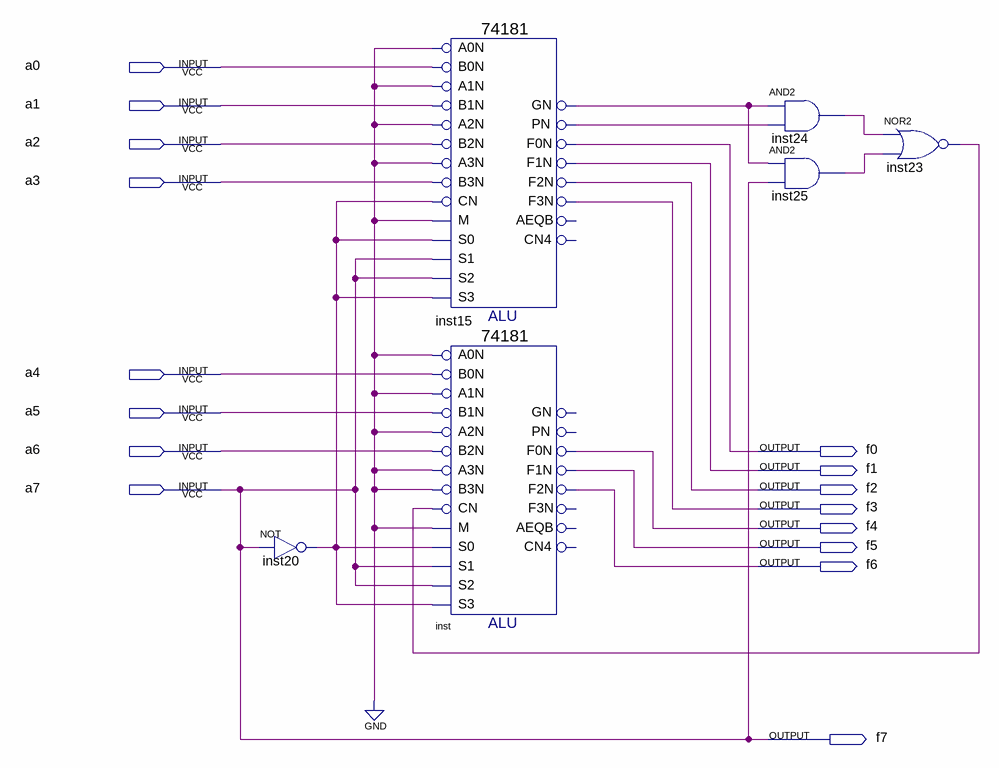
[diagram p0: schematic sheet]
// Quartus schematic BYDecoder.bdf as structural Verilog: 6 symbols, 16 pins
module BYDecoder (
  input  a0,
  input  a1,
  input  a2,
  input  a3,
  input  a4,
  input  a5,
  input  a6,
  input  a7,
  output f0,
  output f1,
  output f2,
  output f3,
  output f4,
  output f5,
  output f6,
  output f7
);

  wire inst15_gn, inst15_pn, inst20_out, inst23_out, inst24_out, inst25_out;

  not inst20 (inst20_out, a7);
  \74181  inst15 (
    .B0N(a0), .A0N(1'b0), .A1N(1'b0), .B1N(a1), .A3N(1'b0), .B2N(a2), .A2N(1'b0), .M(1'b0), .CN(inst20_out),
    .B3N(a3), .S2(a7), .S1(a7), .S0(inst20_out), .S3(inst20_out), .PN(inst15_pn), .GN(inst15_gn), .F3N(f3),
    .F1N(f1), .F0N(f0), .F2N(f2));  // open: AEQB, CN4
  \74181  inst (
    .B0N(a4), .A0N(1'b0), .A1N(1'b0), .B1N(a5), .A3N(1'b0), .B2N(a6), .A2N(1'b0), .M(1'b0), .CN(inst23_out),
    .B3N(1'b0), .S2(a7), .S1(a7), .S0(inst20_out), .S3(inst20_out), .F1N(f5), .F0N(f4), .F2N(f6));  // open: PN, GN, F3N, AEQB, CN4
  and inst24 (inst24_out, inst15_gn, inst15_pn);
  and inst25 (inst25_out, inst15_gn, a7);
  nor inst23 (inst23_out, inst24_out, inst25_out);

  assign f7 = a7;
endmodule
